# EAGLE board rgblight (EAGLE 5.06), part 1 of 2
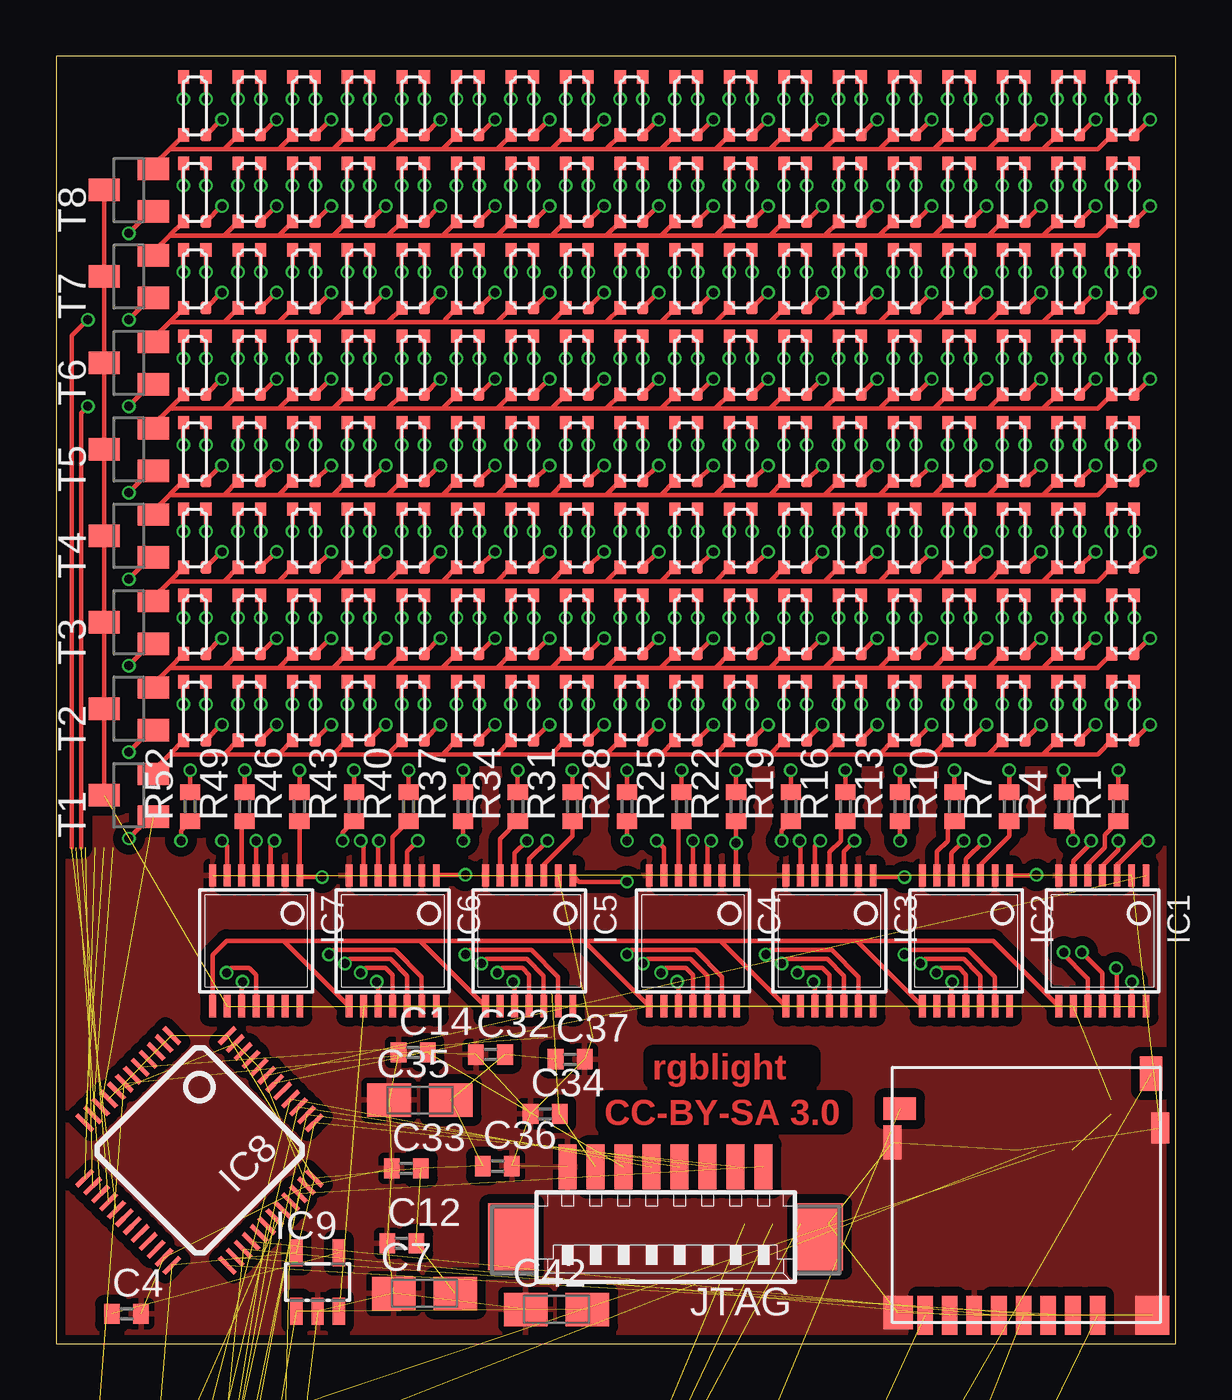
[diagram p1: board, top side]
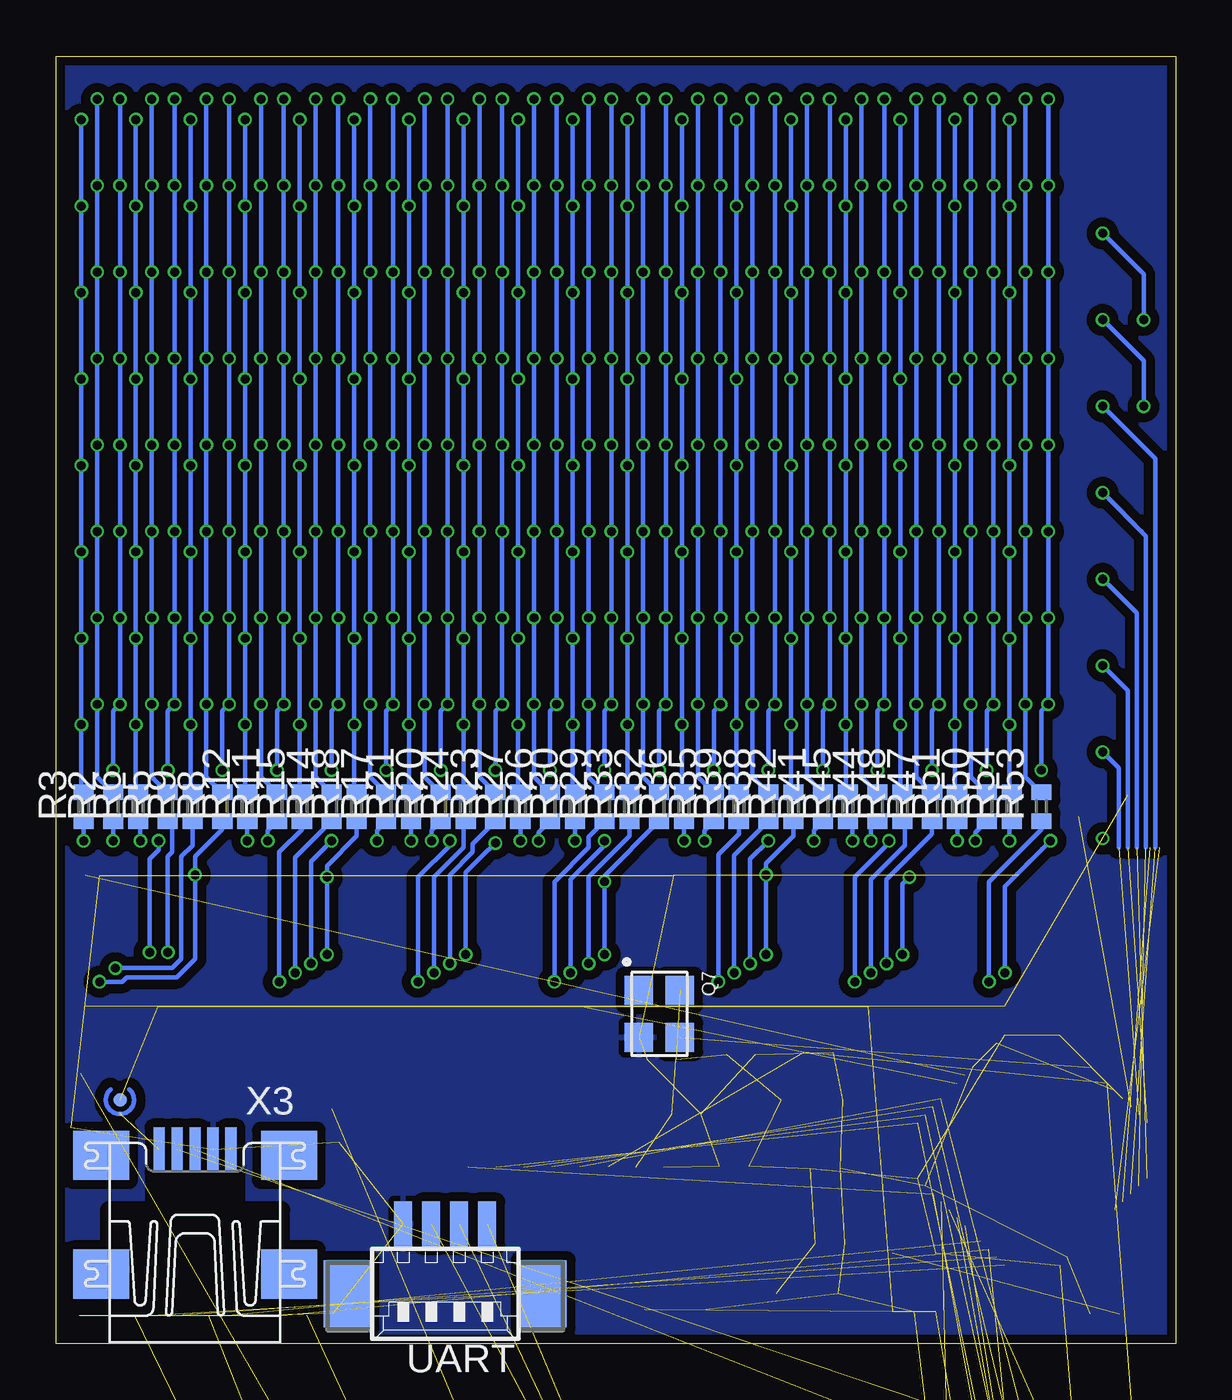
[diagram p2: board, bottom side, seen from below]

Size 50 x 57.5 mm. Coordinates in mm from the lower left corner, seen from the top.
Outline: 0,0 50,0 50,57.5 0,57.5 0,0
Copper layers (1*16): Top 0.035mm / dielectric 1.5mm / Bottom 0.035mm
Design rules "default *": minimum track width 8mil, minimum drill 0.4mm, track to track 8mil, track to pad 8mil, pad to pad 8mil, via to via 8mil, smd to smd 8mil, copper to edge 16mil, drill to drill 8mil, minimum pad ring 8mil, minimum via ring 0.1mm, stop-mask expansion 4mil, vias tented up to drill 0mil, thermal gap 10mil

## Footprints (pad centres in the part's own frame; a part is rotated, then mirrored left to right if it is on the bottom)
A/3216-18R = smd 1.95 x 1.5: + 1.375,0; - -1.375,0
C0402 = smd 0.7 x 0.9: 1 -0.65,0; 2 0.65,0
CIRC_JMP = smd 0.61 x 0.61: 1 0,0 | smd 0.203 x 0.203: 2 0,0.617
TSSOP14 = smd 0.305 x 0.991: 1 -1.95,-2.918; 2 -1.3,-2.918; 3 -0.65,-2.918; 4 0,-2.918; 5 0.65,-2.918; 6 1.3,-2.918; 7 1.95,-2.918; 8 1.95,2.918; 9 1.3,2.918; 10 0.65,2.918; 11 0,2.918; 12 -0.65,2.918; 13 -1.3,2.918; 14 -1.95,2.918
TQFP48 = smd 0.2 x 1: 1 -2.75,-4.5; 2 -2.25,-4.5; 3 -1.75,-4.5; 4 -1.25,-4.5; 5 -0.75,-4.5; 6 -0.25,-4.5; 7 0.25,-4.5; 8 0.75,-4.5; 9 1.25,-4.5; 10 1.75,-4.5; 11 2.25,-4.5; 12 2.75,-4.5; 25 2.75,4.5; 26 2.25,4.5; 27 1.75,4.5; 28 1.25,4.5; 29 0.75,4.5; 30 0.25,4.5; 31 -0.25,4.5; 32 -0.75,4.5; 33 -1.25,4.5; 34 -1.75,4.5; 35 -2.25,4.5; 36 -2.75,4.5 | smd 1 x 0.2: 13 4.5,-2.75; 14 4.5,-2.25; 15 4.5,-1.75; 16 4.5,-1.25; 17 4.5,-0.75; 18 4.5,-0.25; 19 4.5,0.25; 20 4.5,0.75; 21 4.5,1.25; 22 4.5,1.75; 23 4.5,2.25; 24 4.5,2.75; 37 -4.5,2.75; 38 -4.5,2.25; 39 -4.5,1.75; 40 -4.5,1.25; 41 -4.5,0.75; 42 -4.5,0.25; 43 -4.5,-0.25; 44 -4.5,-0.75; 45 -4.5,-1.25; 46 -4.5,-1.75; 47 -4.5,-2.25; 48 -4.5,-2.75
SOT23-5 = smd 0.55 x 1.2: 1 -0.95,-1.3; 2 0,-1.3; 3 0.95,-1.3; 4 0.95,1.3; 5 -0.95,1.3
53261-08 = smd 0.8 x 2: 1 4.375,-2.5; 2 3.125,-2.5; 3 1.875,-2.5; 4 0.625,-2.5; 5 -0.625,-2.5; 6 -1.875,-2.5; 7 -3.125,-2.5; 8 -4.375,-2.5 | smd 2.1 x 3: S1 6.875,0.625; S2 -6.875,0.625
R0603 = smd 1 x 1.1: 1 -0.85,0; 2 0.85,0
OVSRRGB = smd 0.5 x 0.6: 1 0.5,-1.3; 2 0.5,1.3; 3 -0.5,1.3; 4 -0.5,-1.3
ASE_OSCILLATOR = smd 1.295 x 1.27: 1 -1.041,-0.902; 2 1.067,-0.902; 3 1.067,0.927; 4 -1.041,0.927
R0402 = smd 0.7 x 0.9: 1 -0.65,0; 2 0.65,0
SOT23-BCE = smd 1 x 1.4: B -0.95,-1.1; C 0.95,-1.1; E 0,1.1
53261-04 = smd 0.8 x 2: 1 1.875,-2.5; 2 0.625,-2.5; 3 -0.625,-2.5; 4 -1.875,-2.5 | smd 2.1 x 3: S1 4.375,0.625; S2 -4.375,0.625
DM3D-SF = smd 0.7 x 1.75: 1(DAT2) 7.7,-0.875; 2(CD/DAT3) 6.6,-0.875; 3(CMD) 5.5,-0.875; 4(VDD) 4.4,-0.875; 5(CLK) 3.3,-0.875; 6(VSS) 2.2,-0.875; 7(DAT0) 1.1,-0.875; 8(DAT1) 0,-0.875 | smd 1.3 x 1.5: CASE0 -1.2,-0.75 | smd 1.5 x 1.75: CASE1 10.15,-0.875 | smd 0.8 x 1.5: CASE2 -1.45,6.85 | smd 0.8 x 1.4: CASE3 10.5,7.5 | smd 1 x 1.55: CDS(A) 10.1,9.925 | smd 1.45 x 1: CDS(B) -1.125,8.35
UX60A-MB-5ST = smd 2 x 0.5: 1 2.25,1.6; 2 2.25,0.8; 3 2.25,0; 4 2.25,-0.8; 5 2.25,-1.6 | smd 2.2 x 2.5: M1 -3.3,-4.2; M2 -3.3,4.2; M3 2,4.2; M4 2,-4.2

## Placement (x,y rotation side)
C1  4µ7  [A/3216-18R]  -1.32,-109.73 0 top  (outside the outline)
C4  10nF  [C0402]  3.15,1.32 0 top
C7  4µ7  [A/3216-18R]  16.46,2.24 0 top
C12  10nF  [C0402]  15.44,4.47 0 top
C14  100nF  [C0402]  15.95,13 0 top
C17  47p  [C0402]  9.55,-10.87 0 top  (outside the outline)
C18  47p  [C0402]  4.57,-17.48 0 top  (outside the outline)
C32  100nF  [C0402]  19.41,12.9 0 top
C33  100nF  [C0402]  15.65,7.82 0 top
C34  100nF  [C0402]  21.84,10.26 0 top
C35  4µ7  [A/3216-18R]  16.26,10.87 0 top
C36  10nF  [C0402]  19.71,7.92 0 top
C37  1µ  [C0402]  22.96,12.7 0 top
C42  4µ7  [A/3216-18R]  22.35,1.52 0 top
CJ1  CIRC_JMP  [CIRC_JMP]  47.14,10.87 180 bottom
CJ2  CIRC_JMP  [CIRC_JMP]  -1.73,-72.95 0 top  (outside the outline)
IC1  74164PW  [TSSOP14]  46.74,17.98 180 top
IC2  74164PW  [TSSOP14]  40.64,17.98 180 top
IC3  74164PW  [TSSOP14]  34.54,17.98 180 top
IC4  74164PW  [TSSOP14]  28.45,17.98 180 top
IC5  74164PW  [TSSOP14]  21.13,17.98 180 top
IC6  74164PW  [TSSOP14]  15.04,17.98 180 top
IC7  74164PW  [TSSOP14]  8.94,17.98 180 top
IC8  STM32-48  [TQFP48]  6.41,8.62 225 top
IC9  LP2992  [SOT23-5]  11.68,2.74 0 top
JTAG  53261-08  [53261-08]  27.23,5.38 180 top
L1  [R0603]  1.83,-105.36 0 top  (outside the outline)
LED1  OVSRRGB  [OVSRRGB]  47.65,28.24 0 top
LED2  OVSRRGB  [OVSRRGB]  45.21,28.24 0 top
LED3  OVSRRGB  [OVSRRGB]  42.77,28.24 0 top
LED4  OVSRRGB  [OVSRRGB]  40.34,28.24 0 top
LED5  OVSRRGB  [OVSRRGB]  37.9,28.24 0 top
LED6  OVSRRGB  [OVSRRGB]  35.46,28.24 0 top
LED7  OVSRRGB  [OVSRRGB]  33.02,28.24 0 top
LED8  OVSRRGB  [OVSRRGB]  30.58,28.24 0 top
LED9  OVSRRGB  [OVSRRGB]  28.14,28.24 0 top
LED10  OVSRRGB  [OVSRRGB]  25.7,28.24 0 top
LED11  OVSRRGB  [OVSRRGB]  23.27,28.24 0 top
LED12  OVSRRGB  [OVSRRGB]  20.83,28.24 0 top
LED13  OVSRRGB  [OVSRRGB]  18.39,28.24 0 top
LED14  OVSRRGB  [OVSRRGB]  15.95,28.24 0 top
LED15  OVSRRGB  [OVSRRGB]  13.51,28.24 0 top
LED16  OVSRRGB  [OVSRRGB]  11.07,28.24 0 top
LED17  OVSRRGB  [OVSRRGB]  8.64,28.24 0 top
LED18  OVSRRGB  [OVSRRGB]  6.2,28.24 0 top
LED19  OVSRRGB  [OVSRRGB]  47.65,32.11 0 top
LED20  OVSRRGB  [OVSRRGB]  45.21,32.11 0 top
LED21  OVSRRGB  [OVSRRGB]  42.77,32.11 0 top
LED22  OVSRRGB  [OVSRRGB]  40.34,32.11 0 top
LED23  OVSRRGB  [OVSRRGB]  37.9,32.11 0 top
LED24  OVSRRGB  [OVSRRGB]  35.46,32.11 0 top
LED25  OVSRRGB  [OVSRRGB]  33.02,32.11 0 top
LED26  OVSRRGB  [OVSRRGB]  30.58,32.11 0 top
LED27  OVSRRGB  [OVSRRGB]  28.14,32.11 0 top
LED28  OVSRRGB  [OVSRRGB]  25.7,32.11 0 top
LED29  OVSRRGB  [OVSRRGB]  23.27,32.11 0 top
LED30  OVSRRGB  [OVSRRGB]  20.83,32.11 0 top
LED31  OVSRRGB  [OVSRRGB]  18.39,32.11 0 top
LED32  OVSRRGB  [OVSRRGB]  15.95,32.11 0 top
LED33  OVSRRGB  [OVSRRGB]  13.51,32.11 0 top
LED34  OVSRRGB  [OVSRRGB]  11.07,32.11 0 top
LED35  OVSRRGB  [OVSRRGB]  8.64,32.11 0 top
LED36  OVSRRGB  [OVSRRGB]  6.2,32.11 0 top
LED37  OVSRRGB  [OVSRRGB]  47.65,35.97 0 top
LED38  OVSRRGB  [OVSRRGB]  45.21,35.97 0 top
LED39  OVSRRGB  [OVSRRGB]  42.77,35.97 0 top
LED40  OVSRRGB  [OVSRRGB]  40.34,35.97 0 top
LED41  OVSRRGB  [OVSRRGB]  37.9,35.97 0 top
LED42  OVSRRGB  [OVSRRGB]  35.46,35.97 0 top
LED43  OVSRRGB  [OVSRRGB]  33.02,35.97 0 top
LED44  OVSRRGB  [OVSRRGB]  30.58,35.97 0 top
LED45  OVSRRGB  [OVSRRGB]  28.14,35.97 0 top
LED46  OVSRRGB  [OVSRRGB]  25.7,35.97 0 top
LED47  OVSRRGB  [OVSRRGB]  23.27,35.97 0 top
LED48  OVSRRGB  [OVSRRGB]  20.83,35.97 0 top
LED49  OVSRRGB  [OVSRRGB]  18.39,35.97 0 top
LED50  OVSRRGB  [OVSRRGB]  15.95,35.97 0 top
LED51  OVSRRGB  [OVSRRGB]  13.51,35.97 0 top
LED52  OVSRRGB  [OVSRRGB]  11.07,35.97 0 top
LED53  OVSRRGB  [OVSRRGB]  8.64,35.97 0 top
LED54  OVSRRGB  [OVSRRGB]  6.2,35.97 0 top
LED55  OVSRRGB  [OVSRRGB]  47.65,39.83 0 top
LED56  OVSRRGB  [OVSRRGB]  45.21,39.83 0 top
LED57  OVSRRGB  [OVSRRGB]  42.77,39.83 0 top
LED58  OVSRRGB  [OVSRRGB]  40.34,39.83 0 top
LED59  OVSRRGB  [OVSRRGB]  37.9,39.83 0 top
LED60  OVSRRGB  [OVSRRGB]  35.46,39.83 0 top
LED61  OVSRRGB  [OVSRRGB]  33.02,39.83 0 top
LED62  OVSRRGB  [OVSRRGB]  30.58,39.83 0 top
LED63  OVSRRGB  [OVSRRGB]  28.14,39.83 0 top
LED64  OVSRRGB  [OVSRRGB]  25.7,39.83 0 top
LED65  OVSRRGB  [OVSRRGB]  23.27,39.83 0 top
LED66  OVSRRGB  [OVSRRGB]  20.83,39.83 0 top
LED67  OVSRRGB  [OVSRRGB]  18.39,39.83 0 top
LED68  OVSRRGB  [OVSRRGB]  15.95,39.83 0 top
LED69  OVSRRGB  [OVSRRGB]  13.51,39.83 0 top
LED70  OVSRRGB  [OVSRRGB]  11.07,39.83 0 top
LED71  OVSRRGB  [OVSRRGB]  8.64,39.83 0 top
LED72  OVSRRGB  [OVSRRGB]  6.2,39.83 0 top
LED73  OVSRRGB  [OVSRRGB]  47.65,43.69 0 top
LED74  OVSRRGB  [OVSRRGB]  45.21,43.69 0 top
LED75  OVSRRGB  [OVSRRGB]  42.77,43.69 0 top
LED76  OVSRRGB  [OVSRRGB]  40.34,43.69 0 top
LED77  OVSRRGB  [OVSRRGB]  37.9,43.69 0 top
LED78  OVSRRGB  [OVSRRGB]  35.46,43.69 0 top
LED79  OVSRRGB  [OVSRRGB]  33.02,43.69 0 top
LED80  OVSRRGB  [OVSRRGB]  30.58,43.69 0 top
LED81  OVSRRGB  [OVSRRGB]  28.14,43.69 0 top
LED82  OVSRRGB  [OVSRRGB]  25.7,43.69 0 top
LED83  OVSRRGB  [OVSRRGB]  23.27,43.69 0 top
LED84  OVSRRGB  [OVSRRGB]  20.83,43.69 0 top
LED85  OVSRRGB  [OVSRRGB]  18.39,43.69 0 top
LED86  OVSRRGB  [OVSRRGB]  15.95,43.69 0 top
LED87  OVSRRGB  [OVSRRGB]  13.51,43.69 0 top
LED88  OVSRRGB  [OVSRRGB]  11.07,43.69 0 top
LED89  OVSRRGB  [OVSRRGB]  8.64,43.69 0 top
LED90  OVSRRGB  [OVSRRGB]  6.2,43.69 0 top
LED91  OVSRRGB  [OVSRRGB]  47.65,47.55 0 top
LED92  OVSRRGB  [OVSRRGB]  45.21,47.55 0 top
LED93  OVSRRGB  [OVSRRGB]  42.77,47.55 0 top
LED94  OVSRRGB  [OVSRRGB]  40.34,47.55 0 top
LED95  OVSRRGB  [OVSRRGB]  37.9,47.55 0 top
LED96  OVSRRGB  [OVSRRGB]  35.46,47.55 0 top
LED97  OVSRRGB  [OVSRRGB]  33.02,47.55 0 top
LED98  OVSRRGB  [OVSRRGB]  30.58,47.55 0 top
LED99  OVSRRGB  [OVSRRGB]  28.14,47.55 0 top
LED100  OVSRRGB  [OVSRRGB]  25.7,47.55 0 top
LED101  OVSRRGB  [OVSRRGB]  23.27,47.55 0 top
LED102  OVSRRGB  [OVSRRGB]  20.83,47.55 0 top
LED103  OVSRRGB  [OVSRRGB]  18.39,47.55 0 top
LED104  OVSRRGB  [OVSRRGB]  15.95,47.55 0 top
LED105  OVSRRGB  [OVSRRGB]  13.51,47.55 0 top
LED106  OVSRRGB  [OVSRRGB]  11.07,47.55 0 top
LED107  OVSRRGB  [OVSRRGB]  8.64,47.55 0 top
LED108  OVSRRGB  [OVSRRGB]  6.2,47.55 0 top
LED109  OVSRRGB  [OVSRRGB]  47.65,51.41 0 top
LED110  OVSRRGB  [OVSRRGB]  45.21,51.41 0 top
LED111  OVSRRGB  [OVSRRGB]  42.77,51.41 0 top
LED112  OVSRRGB  [OVSRRGB]  40.34,51.41 0 top
LED113  OVSRRGB  [OVSRRGB]  37.9,51.41 0 top
LED114  OVSRRGB  [OVSRRGB]  35.46,51.41 0 top
LED115  OVSRRGB  [OVSRRGB]  33.02,51.41 0 top
LED116  OVSRRGB  [OVSRRGB]  30.58,51.41 0 top
LED117  OVSRRGB  [OVSRRGB]  28.14,51.41 0 top
LED118  OVSRRGB  [OVSRRGB]  25.7,51.41 0 top
LED119  OVSRRGB  [OVSRRGB]  23.27,51.41 0 top
LED120  OVSRRGB  [OVSRRGB]  20.83,51.41 0 top
LED121  OVSRRGB  [OVSRRGB]  18.39,51.41 0 top
LED122  OVSRRGB  [OVSRRGB]  15.95,51.41 0 top
LED123  OVSRRGB  [OVSRRGB]  13.51,51.41 0 top
LED124  OVSRRGB  [OVSRRGB]  11.07,51.41 0 top
LED125  OVSRRGB  [OVSRRGB]  8.64,51.41 0 top
LED126  OVSRRGB  [OVSRRGB]  6.2,51.41 0 top
LED127  OVSRRGB  [OVSRRGB]  47.65,55.27 0 top
LED128  OVSRRGB  [OVSRRGB]  45.21,55.27 0 top
LED129  OVSRRGB  [OVSRRGB]  42.77,55.27 0 top
LED130  OVSRRGB  [OVSRRGB]  40.34,55.27 0 top
LED131  OVSRRGB  [OVSRRGB]  37.9,55.27 0 top
LED132  OVSRRGB  [OVSRRGB]  35.46,55.27 0 top
LED133  OVSRRGB  [OVSRRGB]  33.02,55.27 0 top
LED134  OVSRRGB  [OVSRRGB]  30.58,55.27 0 top
LED135  OVSRRGB  [OVSRRGB]  28.14,55.27 0 top
LED136  OVSRRGB  [OVSRRGB]  25.7,55.27 0 top
LED137  OVSRRGB  [OVSRRGB]  23.27,55.27 0 top
LED138  OVSRRGB  [OVSRRGB]  20.83,55.27 0 top
LED139  OVSRRGB  [OVSRRGB]  18.39,55.27 0 top
LED140  OVSRRGB  [OVSRRGB]  15.95,55.27 0 top
LED141  OVSRRGB  [OVSRRGB]  13.51,55.27 0 top
LED142  OVSRRGB  [OVSRRGB]  11.07,55.27 0 top
LED143  OVSRRGB  [OVSRRGB]  8.64,55.27 0 top
LED144  OVSRRGB  [OVSRRGB]  6.2,55.27 0 top
Q7  8MHz  [ASE_OSCILLATOR]  23.06,14.73 270 bottom
R1  330  [R0402]  47.45,23.98 90 top
R2  330  [R0402]  47.45,23.98 90 bottom
R3  220  [R0402]  48.77,23.98 90 bottom
R4  330  [R0402]  45.01,23.98 90 top
R5  330  [R0402]  45.01,23.98 90 bottom
R6  220  [R0402]  46.33,23.98 90 bottom
R7  330  [R0402]  42.57,23.98 90 top
R8  330  [R0402]  42.57,23.98 90 bottom
R9  220  [R0402]  43.89,23.98 90 bottom
R10  330  [R0402]  40.13,23.98 90 top
R11  330  [R0402]  40.13,23.98 90 bottom
R12  220  [R0402]  41.45,23.98 90 bottom
R13  330  [R0402]  37.69,23.98 90 top
R14  330  [R0402]  37.69,23.98 90 bottom
R15  220  [R0402]  39.01,23.98 90 bottom
R16  330  [R0402]  35.26,23.98 90 top
R17  330  [R0402]  35.26,23.98 90 bottom
R18  220  [R0402]  36.58,23.98 90 bottom
R19  330  [R0402]  32.82,23.98 90 top
R20  330  [R0402]  32.82,23.98 90 bottom
R21  220  [R0402]  34.14,23.98 90 bottom
R22  330  [R0402]  30.38,23.98 90 top
R23  330  [R0402]  30.38,23.98 90 bottom
R24  220  [R0402]  31.7,23.98 90 bottom
R25  330  [R0402]  27.94,23.98 90 top
R26  330  [R0402]  27.94,23.98 90 bottom
R27  220  [R0402]  29.26,23.98 90 bottom
R28  330  [R0402]  25.5,23.98 90 top
R29  330  [R0402]  25.5,23.98 90 bottom
R30  220  [R0402]  26.82,23.98 90 bottom
R31  330  [R0402]  23.06,23.98 90 top
R32  330  [R0402]  23.06,23.98 90 bottom
R33  220  [R0402]  24.38,23.98 90 bottom
R34  330  [R0402]  20.62,23.98 90 top
R35  330  [R0402]  20.62,23.98 90 bottom
R36  220  [R0402]  21.95,23.98 90 bottom
R37  330  [R0402]  18.19,23.98 90 top
R38  330  [R0402]  18.19,23.98 90 bottom
R39  220  [R0402]  19.51,23.98 90 bottom
R40  330  [R0402]  15.75,23.98 90 top
R41  330  [R0402]  15.75,23.98 90 bottom
R42  220  [R0402]  17.07,23.98 90 bottom
R43  330  [R0402]  13.31,23.98 90 top
R44  330  [R0402]  13.31,23.98 90 bottom
R45  220  [R0402]  14.63,23.98 90 bottom
R46  330  [R0402]  10.87,23.98 90 top
R47  330  [R0402]  10.87,23.98 90 bottom
R48  220  [R0402]  12.19,23.98 90 bottom
R49  330  [R0402]  8.43,23.98 90 top
R50  330  [R0402]  8.43,23.98 90 bottom
R51  220  [R0402]  9.75,23.98 90 bottom
R52  330  [R0402]  5.99,23.98 90 top
R53  330  [R0402]  5.99,23.98 90 bottom
R54  220  [R0402]  7.32,23.98 90 bottom
R55  22  [R0402]  4.57,-5.08 0 top  (outside the outline)
R56  22  [R0402]  9.55,-5.08 0 top  (outside the outline)
R57  1k5  [R0402]  4.57,-11.68 0 top  (outside the outline)
R58  10k  [R0402]  -0.2,-22.45 0 top  (outside the outline)
R59  10k  [R0402]  -0.3,-28.24 0 top  (outside the outline)
R60  10k  [R0402]  -0.41,-34.04 0 top  (outside the outline)
R61  10k  [R0402]  -0.51,-39.83 0 top  (outside the outline)
R62  10k  [R0402]  -0.61,-45.62 0 top  (outside the outline)
R63  10k  [R0402]  -0.71,-51.41 0 top  (outside the outline)
R64  100R  [R0402]  -0.81,-57.2 0 top  (outside the outline)
R65  100R  [R0402]  -0.91,-62.99 0 top  (outside the outline)
R66  10k  [R0402]  -1.02,-68.78 0 top  (outside the outline)
R67  10k  [R0402]  -1.83,-77.11 0 top  (outside the outline)
R68  1k  [R0402]  -1.93,-82.91 0 top  (outside the outline)
R69  10k  [R0402]  -2.03,-88.7 0 top  (outside the outline)
R70  10k  [R0402]  -2.13,-94.49 0 top  (outside the outline)
R71  10k  [R0402]  -2.24,-100.28 0 top  (outside the outline)
T1  [SOT23-BCE]  3.25,24.49 90 top
T2  [SOT23-BCE]  3.25,28.35 90 top
T3  [SOT23-BCE]  3.25,32.21 90 top
T4  [SOT23-BCE]  3.25,36.07 90 top
T5  [SOT23-BCE]  3.25,39.93 90 top
T6  [SOT23-BCE]  3.25,43.79 90 top
T7  [SOT23-BCE]  3.25,47.65 90 top
T8  [SOT23-BCE]  3.25,51.51 90 top
UART  53261-04  [53261-04]  32.61,2.84 180 bottom
X1  SD-SLOT-DM3D-SF  [DM3D-SF]  38.81,2.13 0 top
X3  MINI-USB-UX60A-MB-5ST  [UX60A-MB-5ST]  43.79,6.4 90 bottom